# EAGLE schematic capewings (EAGLE 6.3)
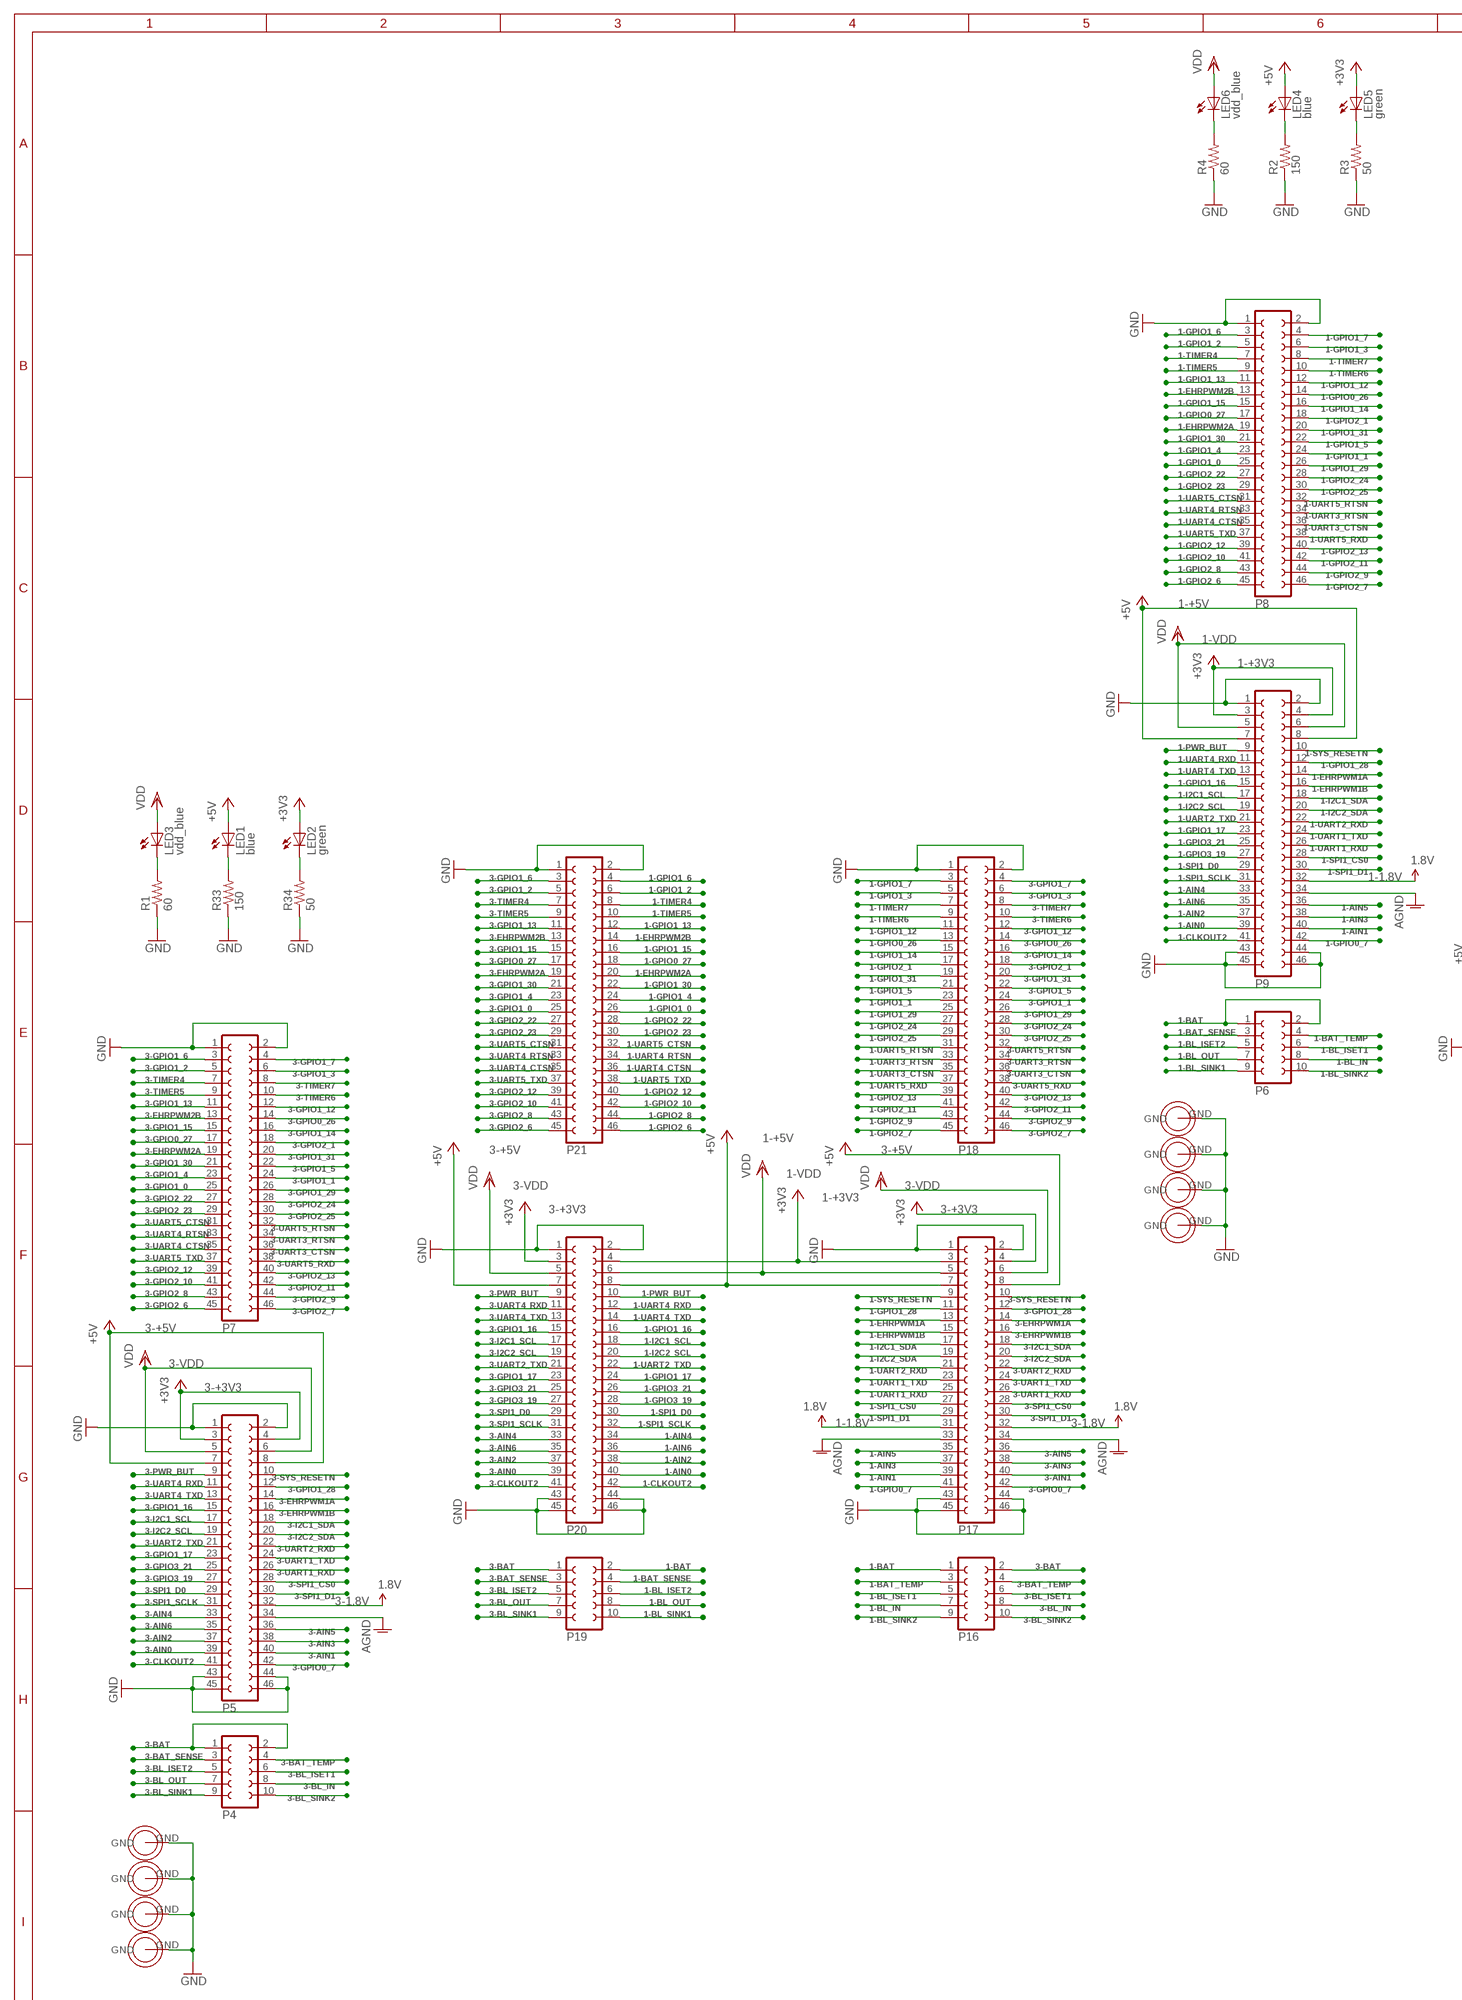
[diagram p0: schematic, sheet 1, part 1 of 2]
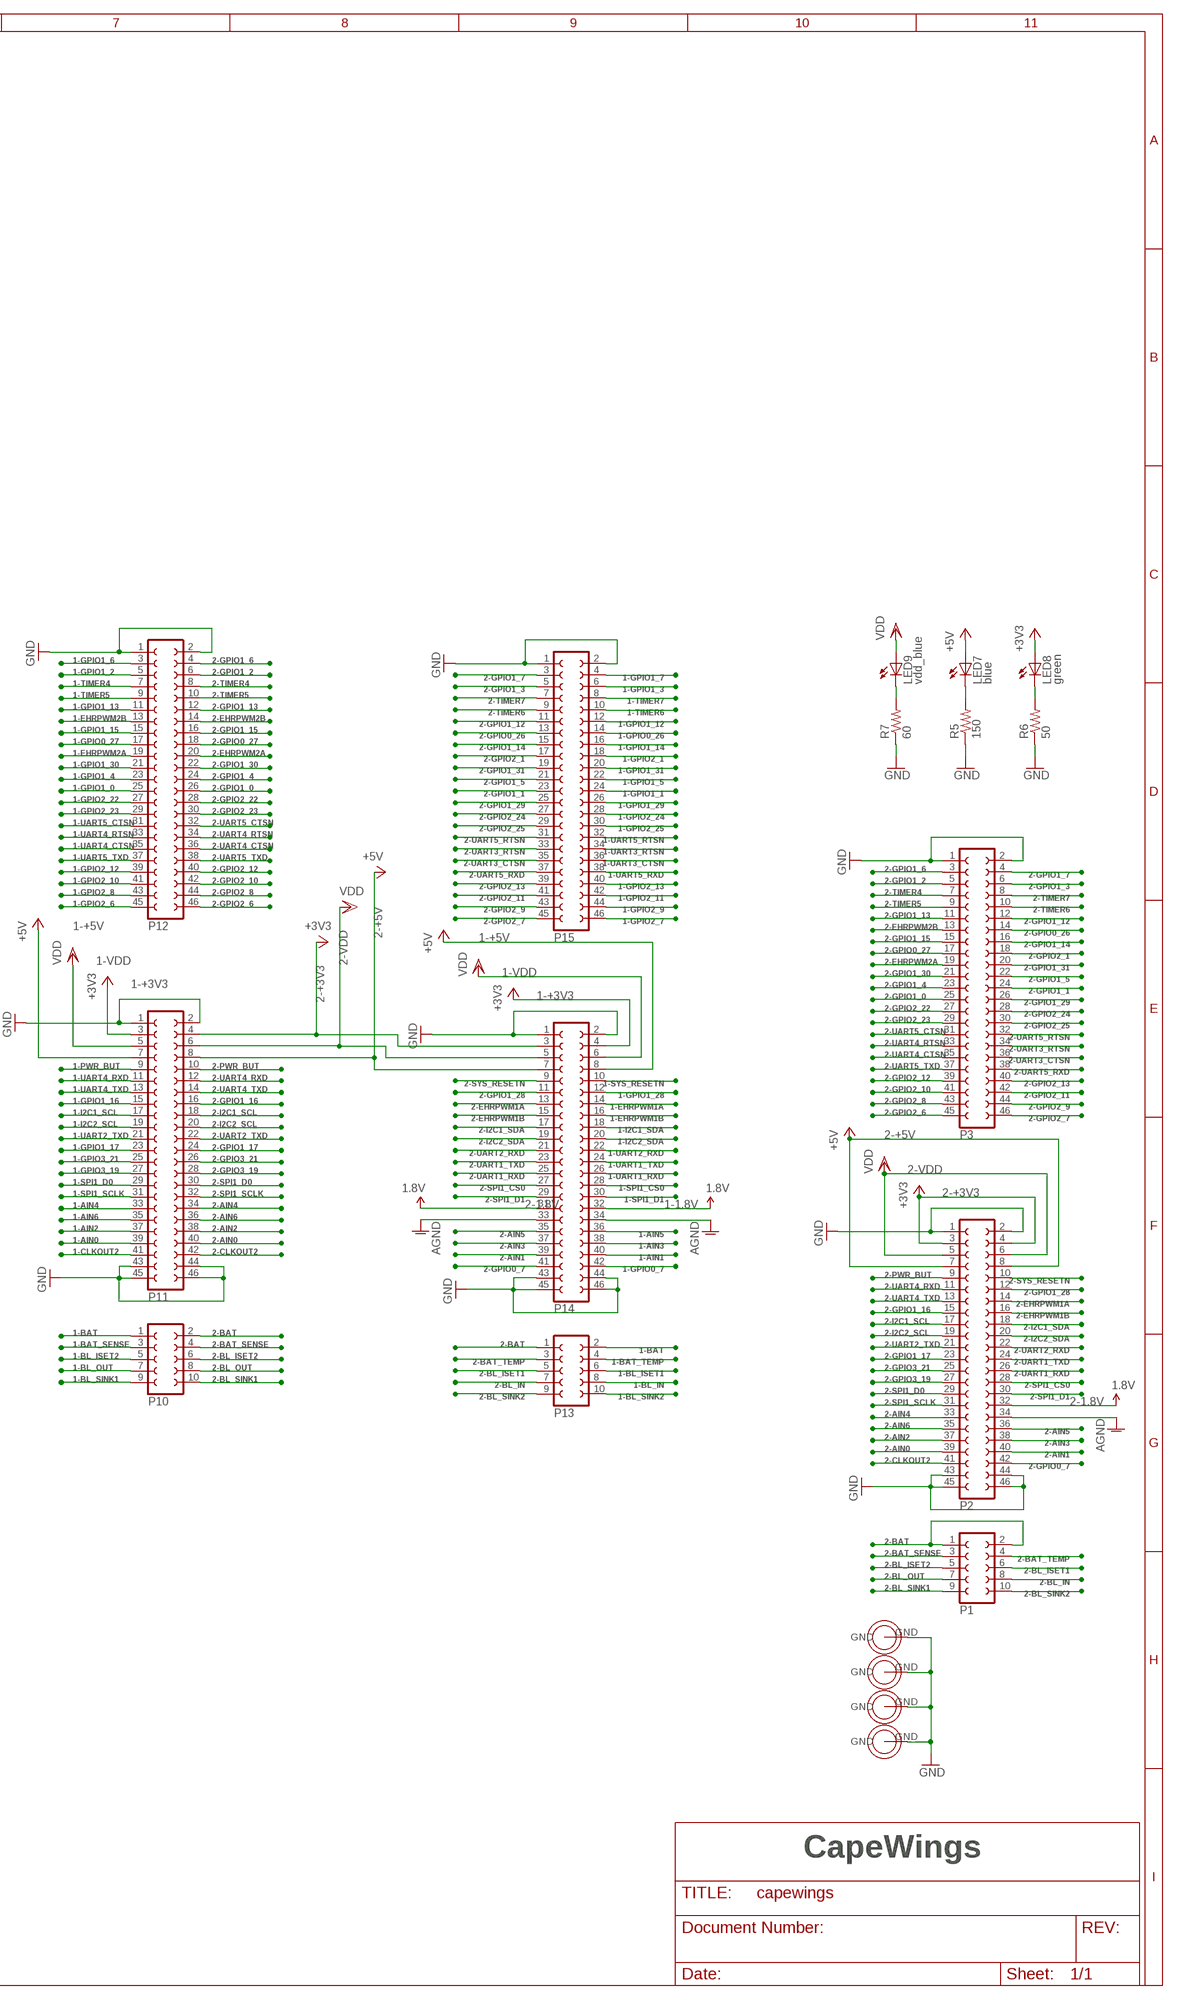
[diagram p1: schematic, sheet 1, part 2 of 2]

## Parts
H1  HOLE  [HOLE]
H2  HOLE  [HOLE]
H3  HOLE  [HOLE]
H4  HOLE  [HOLE]
H5  HOLE  [HOLE]
H6  HOLE  [HOLE]
H7  HOLE  [HOLE]
H8  HOLE  [HOLE]
H9  HOLE  [HOLE]
H10  HOLE  [HOLE]
H11  HOLE  [HOLE]
H12  HOLE  [HOLE]
LED1  blue  LEDCHIPLED_0603  [CHIPLED_0603]
LED2  green  LEDCHIPLED_0603  [CHIPLED_0603]
LED3  vdd_blue  LEDCHIPLED_0603  [CHIPLED_0603]
LED4  blue  LEDCHIPLED_0603  [CHIPLED_0603]
LED5  green  LEDCHIPLED_0603  [CHIPLED_0603]
LED6  vdd_blue  LEDCHIPLED_0603  [CHIPLED_0603]
LED7  blue  LEDCHIPLED_0603  [CHIPLED_0603]
LED8  green  LEDCHIPLED_0603  [CHIPLED_0603]
LED9  vdd_blue  LEDCHIPLED_0603  [CHIPLED_0603]
P1  FE05-2  [FE05-2]
P2  FE23-2  [FE23-2]
P3  FE23-2  [FE23-2]
P4  FE05-2  [FE05-2]
P5  FE23-2  [FE23-2]
P6  FE05-2  [FE05-2]
P7  FE23-2  [FE23-2]
P8  FE23-2  [FE23-2]
P9  FE23-2  [FE23-2]
P10  FE05-2  [FE05-2]
P11  FE23-2  [FE23-2]
P12  FE23-2  [FE23-2]
P13  FE05-2  [FE05-2]
P14  FE23-2  [FE23-2]
P15  FE23-2  [FE23-2]
P16  FE05-2  [FE05-2]
P17  FE23-2  [FE23-2]
P18  FE23-2  [FE23-2]
P19  FE05-2  [FE05-2]
P20  FE23-2  [FE23-2]
P21  FE23-2  [FE23-2]
R1  60  R-US_R0603  [R0603]
R2  150  R-US_R0603  [R0603]
R3  50  R-US_R0603  [R0603]
R4  60  R-US_R0603  [R0603]
R5  150  R-US_R0603  [R0603]
R6  50  R-US_R0603  [R0603]
R7  60  R-US_R0603  [R0603]
R33  150  R-US_R0603  [R0603]
R34  50  R-US_R0603  [R0603]

## Nets
1-1.8V: P9.32 P14.32 P17.31 ; supply symbol labelled 1.8V
1-+3V3 [pwr]: LED5.A P9.3 P9.4 P11.3 P14.4 P17.3 P20.4 ; supply symbol labelled +3V3
1-+5V [pwr]: LED4.A P9.7 P9.8 P11.7 P14.8 P17.7 P20.8 ; supply symbol labelled +5V
1-AIN0: P9.39 P11.39 P20.40
1-AIN1: P9.40 P14.40 P17.39
1-AIN2: P9.37 P11.37 P20.38
1-AIN3: P9.38 P14.38 P17.37
1-AIN4: P9.33 P11.33 P20.34
1-AIN5: P9.36 P14.36 P17.35
1-AIN6: P9.35 P11.35 P20.36
1-BAT: P6.1 P6.2 P10.1 P13.2 P16.1 P19.2
1-BAT_SENSE: P6.3 P10.3 P19.4
1-BAT_TEMP: P6.4 P13.4 P16.3
1-BL_IN: P6.8 P13.8 P16.7
1-BL_ISET1: P6.6 P13.6 P16.5
1-BL_ISET2: P6.5 P10.5 P19.6
1-BL_OUT: P6.7 P10.7 P19.8
1-BL_SINK1: P6.9 P10.9 P19.10
1-BL_SINK2: P6.10 P13.10 P16.9
1-CLKOUT2: P9.41 P11.41 P20.42
1-EHRPWM1A: P9.14 P14.14 P17.13
1-EHRPWM1B: P9.16 P14.16 P17.15
1-EHRPWM2A: P8.19 P12.19 P21.20
1-EHRPWM2B: P8.13 P12.13 P21.14
1-GPIO0_7: P9.42 P14.42 P17.41
1-GPIO0_26: P8.14 P15.14 P18.13
1-GPIO0_27: P8.17 P12.17 P21.18
1-GPIO1_0: P8.25 P12.25 P21.26
1-GPIO1_1: P8.24 P15.24 P18.23
1-GPIO1_2: P8.5 P12.5 P21.6
1-GPIO1_3: P8.6 P15.6 P18.5
1-GPIO1_4: P8.23 P12.23 P21.24
1-GPIO1_5: P8.22 P15.22 P18.21
1-GPIO1_6: P8.3 P12.3 P21.4
1-GPIO1_7: P8.4 P15.4 P18.3
1-GPIO1_12: P8.12 P15.12 P18.11
1-GPIO1_13: P8.11 P12.11 P21.12
1-GPIO1_14: P8.16 P15.16 P18.15
1-GPIO1_15: P8.15 P12.15 P21.16
1-GPIO1_16: P9.15 P11.15 P20.16
1-GPIO1_17: P9.23 P11.23 P20.24
1-GPIO1_28: P9.12 P14.12 P17.11
1-GPIO1_29: P8.26 P15.26 P18.25
1-GPIO1_30: P8.21 P12.21 P21.22
1-GPIO1_31: P8.20 P15.20 P18.19
1-GPIO2_1: P8.18 P15.18 P18.17
1-GPIO2_6: P8.45 P12.45 P21.46
1-GPIO2_7: P8.46 P15.46 P18.45
1-GPIO2_8: P8.43 P12.43 P21.44
1-GPIO2_9: P8.44 P15.44 P18.43
1-GPIO2_10: P8.41 P12.41 P21.42
1-GPIO2_11: P8.42 P15.42 P18.41
1-GPIO2_12: P8.39 P12.39 P21.40
1-GPIO2_13: P8.40 P15.40 P18.39
1-GPIO2_22: P8.27 P12.27 P21.28
1-GPIO2_23: P8.29 P12.29 P21.30
1-GPIO2_24: P8.28 P15.28 P18.27
1-GPIO2_25: P8.30 P15.30 P18.29
1-GPIO3_19: P9.27 P11.27 P20.28
1-GPIO3_21: P9.25 P11.25 P20.26
1-I2C1_SCL: P9.17 P11.17 P20.18
1-I2C1_SDA: P9.18 P14.18 P17.17
1-I2C2_SCL: P9.19 P11.19 P20.20
1-I2C2_SDA: P9.20 P14.20 P17.19
1-PWR_BUT: P9.9 P11.9 P20.10
1-SPI1_CS0: P9.28 P14.28 P17.27
1-SPI1_D0: P9.29 P11.29 P20.30
1-SPI1_D1: P9.30 P14.30 P17.29
1-SPI1_SCLK: P9.31 P11.31 P20.32
1-SYS_RESETN: P9.10 P14.10 P17.9
1-TIMER4: P8.7 P12.7 P21.8
1-TIMER5: P8.9 P12.9 P21.10
1-TIMER6: P8.10 P15.10 P18.9
1-TIMER7: P8.8 P15.8 P18.7
1-UART1_RXD: P9.26 P14.26 P17.25
1-UART1_TXD: P9.24 P14.24 P17.23
1-UART2_RXD: P9.22 P14.22 P17.21
1-UART2_TXD: P9.21 P11.21 P20.22
1-UART3_CTSN: P8.36 P15.36 P18.35
1-UART3_RTSN: P8.34 P15.34 P18.33
1-UART4_CTSN: P8.35 P12.35 P21.36
1-UART4_RTSN: P8.33 P12.33 P21.34
1-UART4_RXD: P9.11 P11.11 P20.12
1-UART4_TXD: P9.13 P11.13 P20.14
1-UART5_CTSN: P8.31 P12.31 P21.32
1-UART5_RTSN: P8.32 P15.32 P18.31
1-UART5_RXD: P8.38 P15.38 P18.37
1-UART5_TXD: P8.37 P12.37 P21.38
1-VDD [pwr]: LED6.A P9.5 P9.6 P11.5 P14.6 P17.5 P20.6 ; supply symbol labelled VDD
2-1.8V: P2.32 P14.31 ; supply symbol labelled 1.8V
2-+3V3 [pwr]: LED8.A P2.3 P2.4 P11.4 P14.3 ; supply symbol labelled +3V3
2-+5V [pwr]: LED7.A P2.7 P2.8 P11.8 P14.7 ; supply symbol labelled +5V
2-AIN0: P2.39 P11.40
2-AIN1: P2.40 P14.39
2-AIN2: P2.37 P11.38
2-AIN3: P2.38 P14.37
2-AIN4: P2.33 P11.34
2-AIN5: P2.36 P14.35
2-AIN6: P2.35 P11.36
2-BAT: P1.1 P1.2 P10.2 P13.1
2-BAT_SENSE: P1.3 P10.4
2-BAT_TEMP: P1.4 P13.3
2-BL_IN: P1.8 P13.7
2-BL_ISET1: P1.6 P13.5
2-BL_ISET2: P1.5 P10.6
2-BL_OUT: P1.7 P10.8
2-BL_SINK1: P1.9 P10.10
2-BL_SINK2: P1.10 P13.9
2-CLKOUT2: P2.41 P11.42
2-EHRPWM1A: P2.14 P14.13
2-EHRPWM1B: P2.16 P14.15
2-EHRPWM2A: P3.19 P12.20
2-EHRPWM2B: P3.13 P12.14
2-GPIO0_7: P2.42 P14.41
2-GPIO0_26: P3.14 P15.13
2-GPIO0_27: P3.17 P12.18
2-GPIO1_0: P3.25 P12.26
2-GPIO1_1: P3.24 P15.23
2-GPIO1_2: P3.5 P12.6
2-GPIO1_3: P3.6 P15.5
2-GPIO1_4: P3.23 P12.24
2-GPIO1_5: P3.22 P15.21
2-GPIO1_6: P3.3 P12.4
2-GPIO1_7: P3.4 P15.3
2-GPIO1_12: P3.12 P15.11
2-GPIO1_13: P3.11 P12.12
2-GPIO1_14: P3.16 P15.15
2-GPIO1_15: P3.15 P12.16
2-GPIO1_16: P2.15 P11.16
2-GPIO1_17: P2.23 P11.24
2-GPIO1_28: P2.12 P14.11
2-GPIO1_29: P3.26 P15.25
2-GPIO1_30: P3.21 P12.22
2-GPIO1_31: P3.20 P15.19
2-GPIO2_1: P3.18 P15.17
2-GPIO2_6: P3.45 P12.46
2-GPIO2_7: P3.46 P15.45
2-GPIO2_8: P3.43 P12.44
2-GPIO2_9: P3.44 P15.43
2-GPIO2_10: P3.41 P12.42
2-GPIO2_11: P3.42 P15.41
2-GPIO2_12: P3.39 P12.40
2-GPIO2_13: P3.40 P15.39
2-GPIO2_22: P3.27 P12.28
2-GPIO2_23: P3.29 P12.30
2-GPIO2_24: P3.28 P15.27
2-GPIO2_25: P3.30 P15.29
2-GPIO3_19: P2.27 P11.28
2-GPIO3_21: P2.25 P11.26
2-I2C1_SCL: P2.17 P11.18
2-I2C1_SDA: P2.18 P14.17
2-I2C2_SCL: P2.19 P11.20
2-I2C2_SDA: P2.20 P14.19
2-PWR_BUT: P2.9 P11.10
2-SPI1_CS0: P2.28 P14.27
2-SPI1_D0: P2.29 P11.30
2-SPI1_D1: P2.30 P14.29
2-SPI1_SCLK: P2.31 P11.32
2-SYS_RESETN: P2.10 P14.9
2-TIMER4: P3.7 P12.8
2-TIMER5: P3.9 P12.10
2-TIMER6: P3.10 P15.9
2-TIMER7: P3.8 P15.7
2-UART1_RXD: P2.26 P14.25
2-UART1_TXD: P2.24 P14.23
2-UART2_RXD: P2.22 P14.21
2-UART2_TXD: P2.21 P11.22
2-UART3_CTSN: P3.36 P15.35
2-UART3_RTSN: P3.34 P15.33
2-UART4_CTSN: P3.35 P12.36
2-UART4_RTSN: P3.33 P12.34
2-UART4_RXD: P2.11 P11.12
2-UART4_TXD: P2.13 P11.14
2-UART5_CTSN: P3.31 P12.32
2-UART5_RTSN: P3.32 P15.31
2-UART5_RXD: P3.38 P15.37
2-UART5_TXD: P3.37 P12.38
2-VDD [pwr]: LED9.A P2.5 P2.6 P11.6 P14.5 ; supply symbol labelled VDD
3-1.8V: P5.32 P17.32 ; supply symbol labelled 1.8V
3-+3V3 [pwr]: LED2.A P5.3 P5.4 P17.4 P20.3 ; supply symbol labelled +3V3
3-+5V [pwr]: LED1.A P5.7 P5.8 P17.8 P20.7 ; supply symbol labelled +5V
3-AIN0: P5.39 P20.39
3-AIN1: P5.40 P17.40
3-AIN2: P5.37 P20.37
3-AIN3: P5.38 P17.38
3-AIN4: P5.33 P20.33
3-AIN5: P5.36 P17.36
3-AIN6: P5.35 P20.35
3-BAT: P4.1 P4.2 P16.2 P19.1
3-BAT_SENSE: P4.3 P19.3
3-BAT_TEMP: P4.4 P16.4
3-BL_IN: P4.8 P16.8
3-BL_ISET1: P4.6 P16.6
3-BL_ISET2: P4.5 P19.5
3-BL_OUT: P4.7 P19.7
3-BL_SINK1: P4.9 P19.9
3-BL_SINK2: P4.10 P16.10
3-CLKOUT2: P5.41 P20.41
3-EHRPWM1A: P5.14 P17.14
3-EHRPWM1B: P5.16 P17.16
3-EHRPWM2A: P7.19 P21.19
3-EHRPWM2B: P7.13 P21.13
3-GPIO0_7: P5.42 P17.42
3-GPIO0_26: P7.14 P18.14
3-GPIO0_27: P7.17 P21.17
3-GPIO1_0: P7.25 P21.25
3-GPIO1_1: P7.24 P18.24
3-GPIO1_2: P7.5 P21.5
3-GPIO1_3: P7.6 P18.6
3-GPIO1_4: P7.23 P21.23
3-GPIO1_5: P7.22 P18.22
3-GPIO1_6: P7.3 P21.3
3-GPIO1_7: P7.4 P18.4
3-GPIO1_12: P7.12 P18.12
3-GPIO1_13: P7.11 P21.11
3-GPIO1_14: P7.16 P18.16
3-GPIO1_15: P7.15 P21.15
3-GPIO1_16: P5.15 P20.15
3-GPIO1_17: P5.23 P20.23
3-GPIO1_28: P5.12 P17.12
3-GPIO1_29: P7.26 P18.26
3-GPIO1_30: P7.21 P21.21
3-GPIO1_31: P7.20 P18.20
3-GPIO2_1: P7.18 P18.18
3-GPIO2_6: P7.45 P21.45
3-GPIO2_7: P7.46 P18.46
3-GPIO2_8: P7.43 P21.43
3-GPIO2_9: P7.44 P18.44
3-GPIO2_10: P7.41 P21.41
3-GPIO2_11: P7.42 P18.42
3-GPIO2_12: P7.39 P21.39
3-GPIO2_13: P7.40 P18.40
3-GPIO2_22: P7.27 P21.27
3-GPIO2_23: P7.29 P21.29
3-GPIO2_24: P7.28 P18.28
3-GPIO2_25: P7.30 P18.30
3-GPIO3_19: P5.27 P20.27
3-GPIO3_21: P5.25 P20.25
3-I2C1_SCL: P5.17 P20.17
3-I2C1_SDA: P5.18 P17.18
3-I2C2_SCL: P5.19 P20.19
3-I2C2_SDA: P5.20 P17.20
3-PWR_BUT: P5.9 P20.9
3-SPI1_CS0: P5.28 P17.28
3-SPI1_D0: P5.29 P20.29
3-SPI1_D1: P5.30 P17.30
3-SPI1_SCLK: P5.31 P20.31
3-SYS_RESETN: P5.10 P17.10
3-TIMER4: P7.7 P21.7
3-TIMER5: P7.9 P21.9
3-TIMER6: P7.10 P18.10
3-TIMER7: P7.8 P18.8
3-UART1_RXD: P5.26 P17.26
3-UART1_TXD: P5.24 P17.24
3-UART2_RXD: P5.22 P17.22
3-UART2_TXD: P5.21 P20.21
3-UART3_CTSN: P7.36 P18.36
3-UART3_RTSN: P7.34 P18.34
3-UART4_CTSN: P7.35 P21.35
3-UART4_RTSN: P7.33 P21.33
3-UART4_RXD: P5.11 P20.11
3-UART4_TXD: P5.13 P20.13
3-UART5_CTSN: P7.31 P21.31
3-UART5_RTSN: P7.32 P18.32
3-UART5_RXD: P7.38 P18.38
3-UART5_TXD: P7.37 P21.37
3-VDD [pwr]: LED3.A P5.5 P5.6 P17.6 P20.5 ; supply symbol labelled VDD
AGND: P2.34 P5.34 P9.34 P14.33 P14.34 P17.33 P17.34
GND [pwr]: H1.GND H2.GND H3.GND H4.GND H5.GND H6.GND H7.GND H8.GND H9.GND H10.GND H11.GND H12.GND P2.1 P2.2 P2.43 P2.44 P2.45 P2.46 P3.1 P3.2 P5.1 P5.2 P5.43 P5.44 P5.45 P5.46 P7.1 P7.2 P8.1 P8.2 P9.1 P9.2 P9.43 P9.44 P9.45 P9.46 P11.1 P11.2 P11.43 P11.44 P11.45 P11.46 P12.1 P12.2 P14.1 P14.2 P14.43 P14.44 P14.45 P14.46 P15.1 P15.2 P17.1 P17.2 P17.43 P17.44 P17.45 P17.46 P18.1 P18.2 P20.1 P20.2 P20.43 P20.44 P20.45 P20.46 P21.1 P21.2 R1.1 R2.1 R3.1 R4.1 R5.1 R6.1 R7.1 R33.1 R34.1
N$1: LED3.C R1.2
N$2: LED4.C R2.2
N$3: LED5.C R3.2
N$4: LED6.C R4.2
N$5: LED7.C R5.2
N$6: LED8.C R6.2
N$7: LED9.C R7.2
N$29: LED1.C R33.2
N$30: LED2.C R34.2

## Notes on the sheet
- CapeWings

## Library data of the parts
H1-H12 = BoneCapeParts:HOLE
LED1 LED4 LED7 = led:LED: LED OSRAM: - CHIPLED LG R971, LG N971, LY N971, LG Q971, LY Q971, LO R971, LY R971 LH N974, LH R974 LS Q976, LO Q976, LY Q976 LO Q996 - Hyper CHIPLED LW Q18S LB Q993, LB Q99A, LB R99A - SideLED LS A670, LO A670, LY A670, LG A670, LP A670 LB A673, LV A673, LT A673, LW A673 LH A674 LY A675 LS A676, LA A676, LO A676, LY A676, LW A676 LS A679, LY A679, LG A679 - Hyper Micro SIDELED® LS Y876, LA Y876, LO Y876, LY Y876 LT Y87S - SmartLED LW L88C, LW L88S LB L89C, LB L89S, LG L890 LS L89K, LO L89K, LY L89K LS L896, LA L896, LO L896, LY L896 - TOPLED LS T670, LO T670, LY T670, LG T670, LP T670 LSG T670, LSP T670, LSY T670, LOP T670, LYG T670 LG T671, LOG T671, LSG T671 LB T673, LV T673, LT T673, LW T673 LH T674 LS T676, LA T676, LO T676, LY T676, LB T676, LH T676, LSB T676, LW T676 LB T67C, LV T67C, LT T67C, LS T67K, LO T67K, LY T67K, LW E67C LS E67B, LA E67B, LO E67B, LY E67B, LB E67C, LV E67C, LT E67C LW T67C LS T679, LY T679, LG T679 LS T770, LO T770, LY T770, LG T770, LP T770 LB T773, LV T773, LT T773, LW T773 LH T774 LS E675, LA E675, LY E675, LS T675 LS T776, LA T776, LO T776, LY T776, LB T776 LHGB T686 LT T68C, LB T68C - Hyper Mini TOPLED® LB M676 - Mini TOPLED Santana® LG M470 LS M47K, LO M47K, LY M47K Source: http://www.osram.convergy.de LUXEON: - LUMILED® LXK2-PW12-R00, LXK2-PW12-S00, LXK2-PW14-U00, LXK2-PW14-V00 LXK2-PM12-R00, LXK2-PM12-S00, LXK2-PM14-U00 LXK2-PE12-Q00, LXK2-PE12-R00, LXK2-PE12-S00, LXK2-PE14-T00, LXK2-PE14-U00 LXK2-PB12-K00, LXK2-PB12-L00, LXK2-PB12-M00, LXK2-PB14-N00, LXK2-PB14-P00, LXK2-PB14-Q00 LXK2-PR12-L00, LXK2-PR12-M00, LXK2-PR14-Q00, LXK2-PR14-R00 LXK2-PD12-Q00, LXK2-PD12-R00, LXK2-PD12-S00 LXK2-PH12-R00, LXK2-PH12-S00 LXK2-PL12-P00, LXK2-PL12-Q00, LXK2-PL12-R00 Source: www.luxeon.com KINGBRIGHT: KA-3528ASYC Source: www.kingbright.com; MPN: HT-193NB-5589
LED2 LED5 LED8 = led:LED: LED OSRAM: - CHIPLED LG R971, LG N971, LY N971, LG Q971, LY Q971, LO R971, LY R971 LH N974, LH R974 LS Q976, LO Q976, LY Q976 LO Q996 - Hyper CHIPLED LW Q18S LB Q993, LB Q99A, LB R99A - SideLED LS A670, LO A670, LY A670, LG A670, LP A670 LB A673, LV A673, LT A673, LW A673 LH A674 LY A675 LS A676, LA A676, LO A676, LY A676, LW A676 LS A679, LY A679, LG A679 - Hyper Micro SIDELED® LS Y876, LA Y876, LO Y876, LY Y876 LT Y87S - SmartLED LW L88C, LW L88S LB L89C, LB L89S, LG L890 LS L89K, LO L89K, LY L89K LS L896, LA L896, LO L896, LY L896 - TOPLED LS T670, LO T670, LY T670, LG T670, LP T670 LSG T670, LSP T670, LSY T670, LOP T670, LYG T670 LG T671, LOG T671, LSG T671 LB T673, LV T673, LT T673, LW T673 LH T674 LS T676, LA T676, LO T676, LY T676, LB T676, LH T676, LSB T676, LW T676 LB T67C, LV T67C, LT T67C, LS T67K, LO T67K, LY T67K, LW E67C LS E67B, LA E67B, LO E67B, LY E67B, LB E67C, LV E67C, LT E67C LW T67C LS T679, LY T679, LG T679 LS T770, LO T770, LY T770, LG T770, LP T770 LB T773, LV T773, LT T773, LW T773 LH T774 LS E675, LA E675, LY E675, LS T675 LS T776, LA T776, LO T776, LY T776, LB T776 LHGB T686 LT T68C, LB T68C - Hyper Mini TOPLED® LB M676 - Mini TOPLED Santana® LG M470 LS M47K, LO M47K, LY M47K Source: http://www.osram.convergy.de LUXEON: - LUMILED® LXK2-PW12-R00, LXK2-PW12-S00, LXK2-PW14-U00, LXK2-PW14-V00 LXK2-PM12-R00, LXK2-PM12-S00, LXK2-PM14-U00 LXK2-PE12-Q00, LXK2-PE12-R00, LXK2-PE12-S00, LXK2-PE14-T00, LXK2-PE14-U00 LXK2-PB12-K00, LXK2-PB12-L00, LXK2-PB12-M00, LXK2-PB14-N00, LXK2-PB14-P00, LXK2-PB14-Q00 LXK2-PR12-L00, LXK2-PR12-M00, LXK2-PR14-Q00, LXK2-PR14-R00 LXK2-PD12-Q00, LXK2-PD12-R00, LXK2-PD12-S00 LXK2-PH12-R00, LXK2-PH12-S00 LXK2-PL12-P00, LXK2-PL12-Q00, LXK2-PL12-R00 Source: www.luxeon.com KINGBRIGHT: KA-3528ASYC Source: www.kingbright.com; MPN: LG Q971-KN-1
LED3 LED6 LED9 = led:LED: LED OSRAM: - CHIPLED LG R971, LG N971, LY N971, LG Q971, LY Q971, LO R971, LY R971 LH N974, LH R974 LS Q976, LO Q976, LY Q976 LO Q996 - Hyper CHIPLED LW Q18S LB Q993, LB Q99A, LB R99A - SideLED LS A670, LO A670, LY A670, LG A670, LP A670 LB A673, LV A673, LT A673, LW A673 LH A674 LY A675 LS A676, LA A676, LO A676, LY A676, LW A676 LS A679, LY A679, LG A679 - Hyper Micro SIDELED® LS Y876, LA Y876, LO Y876, LY Y876 LT Y87S - SmartLED LW L88C, LW L88S LB L89C, LB L89S, LG L890 LS L89K, LO L89K, LY L89K LS L896, LA L896, LO L896, LY L896 - TOPLED LS T670, LO T670, LY T670, LG T670, LP T670 LSG T670, LSP T670, LSY T670, LOP T670, LYG T670 LG T671, LOG T671, LSG T671 LB T673, LV T673, LT T673, LW T673 LH T674 LS T676, LA T676, LO T676, LY T676, LB T676, LH T676, LSB T676, LW T676 LB T67C, LV T67C, LT T67C, LS T67K, LO T67K, LY T67K, LW E67C LS E67B, LA E67B, LO E67B, LY E67B, LB E67C, LV E67C, LT E67C LW T67C LS T679, LY T679, LG T679 LS T770, LO T770, LY T770, LG T770, LP T770 LB T773, LV T773, LT T773, LW T773 LH T774 LS E675, LA E675, LY E675, LS T675 LS T776, LA T776, LO T776, LY T776, LB T776 LHGB T686 LT T68C, LB T68C - Hyper Mini TOPLED® LB M676 - Mini TOPLED Santana® LG M470 LS M47K, LO M47K, LY M47K Source: http://www.osram.convergy.de LUXEON: - LUMILED® LXK2-PW12-R00, LXK2-PW12-S00, LXK2-PW14-U00, LXK2-PW14-V00 LXK2-PM12-R00, LXK2-PM12-S00, LXK2-PM14-U00 LXK2-PE12-Q00, LXK2-PE12-R00, LXK2-PE12-S00, LXK2-PE14-T00, LXK2-PE14-U00 LXK2-PB12-K00, LXK2-PB12-L00, LXK2-PB12-M00, LXK2-PB14-N00, LXK2-PB14-P00, LXK2-PB14-Q00 LXK2-PR12-L00, LXK2-PR12-M00, LXK2-PR14-Q00, LXK2-PR14-R00 LXK2-PD12-Q00, LXK2-PD12-R00, LXK2-PD12-S00 LXK2-PH12-R00, LXK2-PH12-S00 LXK2-PL12-P00, LXK2-PL12-Q00, LXK2-PL12-R00 Source: www.luxeon.com KINGBRIGHT: KA-3528ASYC Source: www.kingbright.com; MPN: VLMB1300-GS08
P1 P4 P6 = con-lsta:FE05-2: FEMALE HEADER; MPN: SSHQ-105-D-10-GT-LF; OC_FARNELL: unknown; OC_NEWARK: unknown
P2 P3 P5 P7-P9 = BoneCapeParts:FE23-2: FEMALE HEADER; MPN: SSHQ-123-D-10-GT-LF; OC_FARNELL: unknown; OC_NEWARK: unknown
P10 P13 P16 P19 = con-lsta:FE05-2: FEMALE HEADER; MPN: TSHC-105-D-03-145-GT-LF; OC_FARNELL: unknown; OC_NEWARK: unknown
P11 P12 P14 P15 P17 P18 P20 P21 = BoneCapeParts:FE23-2: FEMALE HEADER; MPN: TSHC-123-D-03-145-GT-LF; OC_FARNELL: unknown; OC_NEWARK: unknown
R1 R4 R7 = rcl:R-US_: RESISTOR, American symbol; MPN: 302-60.4-RC
R2 R5 R33 = rcl:R-US_: RESISTOR, American symbol; MPN: 302-150-RC
R3 R6 R34 = rcl:R-US_: RESISTOR, American symbol; MPN: 302-49.9-RC

## Net classes
0 default: width 0.152 mm, drill 0.381 mm, clearance 0.152 mm
1 pwr: width 0.305 mm, drill 0.381 mm, clearance 0.152 mm